# Altium schematic sheet Weather Station.SchDoc
size A4; DrawnBy: Rajesh Jasti; DocumentNumber: 1; Revision: ProtoType; SheetNumber: 1; SheetTotal: 1
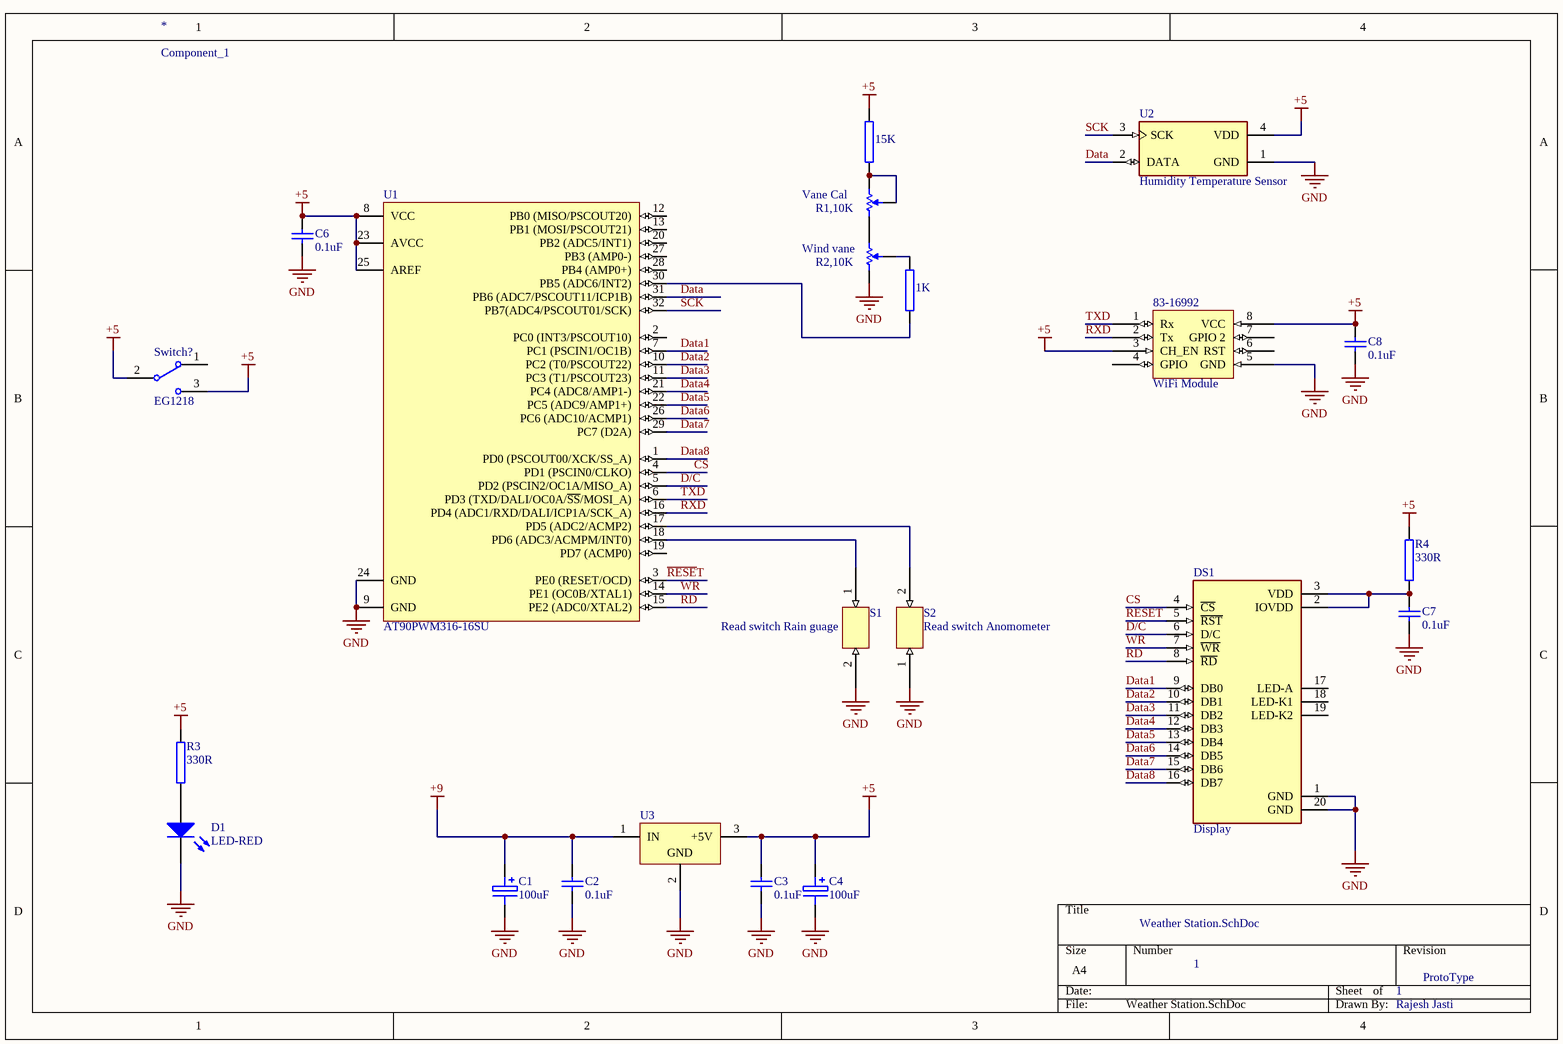
[diagram p0: Weather Station.SchDoc]

## Parts
1K  Resistor 1W  [AXIAL-0.7AUT]  (value not drawn)
15K  Resistor 1W  [AXIAL-0.7AUT]  (value not drawn)
83-16992  WiFi Module
*  Component_1
C1  100uF  [CAPP150-300_AUT]
C2  0.1uF  [RAD-0.1_AUT]
C3  0.1uF  [RAD-0.1_AUT]
C4  100uF  [CAPP150-300_AUT]
C6  0.1uF  [CAP_1206]
C7  0.1uF  [CAP_1206]
C8  0.1uF  [CAP_1206]
D1  LED-RED  [LED3MM_R_AUT]
DS1  Display  [MODULE_NHD-1.8-128160EF-CSXN#]
R1,10K  Vane Cal  [BOUR-TC33X-2_V]
R2,10K  Wind vane  [BOUR-TC33X-2_V]
R3  330R  [AXIAL-0.4AUT]
R4  330R  [AXIAL-0.4AUT]
S1  Read switch Rain guage
S2  Read switch Anomometer
Switch?  EG1218  [ESWI-EG1218_V]
U1  AT90PWM316-16SU  [SO32_M]
U2  Humidity Temperature Sensor  [XDCR_SHT11]
U3  (no value)  [TO-220H]

## Nets
+5: 15K.2 83-16992.3(CH_EN) 83-16992.8(VCC) C3.2 C4.1 C6.2 C8.2 R3.2 R4.2 Switch?.2(COM) Switch?.3 U1.8(VCC) U1.23(AVCC) U1.25(AREF) U2.4(VDD) U3.3(+5V)
+9: C1.1 C2.2 U3.1(IN)
GND: 83-16992.5(GND) C1.2 C2.1 C3.1 C4.2 C6.1 C7.1 C8.1 D1.K DS1.1(GND) DS1.20(GND) R2,10K.1 S1.2 S2.1 U1.9(GND) U1.24(GND) U2.1(GND) U3.2(GND)
CS: DS1.4(~{CS}) U1.4(PD1_(PSCIN0/CLKO))
D/C: DS1.6(D/C) U1.5(PD2_(PSCIN2/OC1A/MISO_A))
Data: U1.31(PB6_(ADC7/PSCOUT11/ICP1B)) U2.2(DATA)
Data1: DS1.9(DB0) U1.7(PC1_(PSCIN1/OC1B))
Data2: DS1.10(DB1) U1.10(PC2_(T0/PSCOUT22))
Data3: DS1.11(DB2) U1.11(PC3_(T1/PSCOUT23))
Data4: DS1.12(DB3) U1.21(PC4_(ADC8/AMP1-))
Data5: DS1.13(DB4) U1.22(PC5_(ADC9/AMP1+))
Data6: DS1.14(DB5) U1.26(PC6_(ADC10/ACMP1))
Data7: DS1.15(DB6) U1.29(PC7_(D2A))
Data8: DS1.16(DB7) U1.1(PD0_(PSCOUT00/XCK/SS_A))
~{R}D: DS1.8(~{RD}) U1.15(PE2_(ADC0/XTAL2))
~{RESE}T: DS1.5(~{RST}) U1.3(PE0_(RESET/OCD))
RXD: 83-16992.2(Tx) U1.16(PD4_(ADC1/RXD/DALI/ICP1A/SCK_A))
SCK: U1.32(PB7(ADC4/PSCOUT01/SCK)) U2.3(SCK)
TXD: 83-16992.1(Rx) U1.6(PD3_(TXD/DALI/OC0A/~{SS}/MOSI_A))
WR: DS1.7(~{WR}) U1.14(PE1_(OC0B/XTAL1))
Net1K_1: 1K.1 U1.30(PB5_(ADC6/INT2))
Net1K_2: 1K.2 R2,10K.2
Net15K_1: 15K.1 R1,10K.2 R1,10K.3
NetC7_2: C7.2 DS1.2(IOVDD) DS1.3(VDD) R4.1
NetD1_A: D1.A R3.1
NetR1,10K_1: R1,10K.1 R2,10K.3
NetS1_1: S1.1 U1.18(PD6_(ADC3/ACMPM/INT0))
NetS2_2: S2.2 U1.17(PD5_(ADC2/ACMP2))

Not connected (* = marked no-connect by the designer): 83-16992 4(GPIO) 6(RST) 7(GPIO_2); DS1 17(LED-A) 18(LED-K1) 19(LED-K2); Switch? 1; U1 2(PC0_(INT3/PSCOUT10)) 12(PB0_(MISO/PSCOUT20)) 13(PB1_(MOSI/PSCOUT21)) 19(PD7_(ACMP0)) 20(PB2_(ADC5/INT1)) 27(PB3_(AMP0-)) 28(PB4_(AMP0+))

## Notes on the sheet
- ProtoType

## Library data of the parts
1K 15K = Resistor 1W: Resistor, Through Hole, Pitch 700mil
83-16992 = Component_1: Supplier 1: Newark; Supplier Part Number 1: 68Y0156
C1 C4 = CAPP150-300: Polarized Aluminum Capacitor, Through Hole, Pitch 150mil, Body 300mil (Dia)
C2 C3 = CAPN RAD0.1: Non Polarized Capacitor, Multilayer Ceramic Dipped Radial, Pitch 100mil
C6-C8 = CAPN 1206: Non Polarized Capacitor, SMD, 1206
D1 = 3mm LED-RED: 3mm RED LED, Through Hole; Supplier 1: Farnell; Supplier Part Number 1: 1003207
DS1 = NHD-1.8-128160EF-CSXN#: Graphic LCD Display Module Transmissive Red, Green, Blue (RGB) TFT - Color Parallel, 8-Bit 1.8 (45.72mm) 128 x 160; MF: Newhaven Display; Package: None; Value: *; Purchase-URL: https://pricing.snapeda.com/search/part/NHD-1.8-128160EF-CSXN#/?ref=eda; Availability: Warning; MP: NHD-1.8-128160EF-CSXN#; Check_prices: https://www.snapeda.com/parts/NHD-1.8-128160EF-CSXN%23/Newhaven%20Display%20Intl/view-part/426299/?ref=eda; SnapEDA_Link: https://www.snapeda.com/parts/NHD-1.8-128160EF-CSXN%23/Newhaven%20Display%20Intl/view-part/426299/?ref=snap; Price: None
R1,10K R2,10K = CMP-009-00060-1: Trimming Potentiometer, 10000 Ohm, -40 to 100 degC, 3-Pin SMD, RoHS, Tape and Reel; Manufacturer: Bourns; Power: 100mW; Tolerance: 25%; Resistance: 10k; Package Description: 3-Pin Surface Mount Device, Body 3.8 x 3.6 mm; Case/Package: TC33X-2; Datasheet Version: Aug-16; Manufacturer URL: http://www.bourns.com/; Min Operating Temperature: -40°C; Datasheet URL: http://www.bourns.com/docs/Product-Datasheets/TC33.pdf; Package Reference: TC33X-2; Packaging: TapeandReel; Composition: Potentiometer; Package Quantity: 2500; Max Operating Temperature: 120°C; RoHS Compliant: True; Mounting Technology: SM
R3 R4 = Resistor 1/4W: Resistor, Through Hole, Pitch 400mil
S1 S2 = R: Supplier 1: Digi-Key; Supplier Part Number 1: 306-1148-1-ND
Switch? = CMP-011-00006-1: Slide Switch, SPDT, 500 V, -20 to 70 degC, 3-Pin THD, RoHS, Bulk; Manufacturer: E-Switch; Operating Force: 250gf; Contact Current Rating: 200mA; Current Rating: 2dA; Voltage Rating (DC): 30V; Packaging: Bulk; Max Operating Temperature: 70°C; Contact Material: Copper; Datasheet URL: https://www.e-switch.com/system/asset/product_line/data_sheet/119/EG.pdf; Case/Package: EG1218; Min Operating Temperature: -20°C; Pins: 3; Throw Configuration: SPDT; Package Description: 3-Pin Through Hole Device, Body 11.6 x 4 mm, Pitch 2.5 mm; Voltage Rating (AC): 30V; Package Reference: EG1218; Datasheet Version: Oct-15; Package Quantity: 1000; Mounting Technology: TH; RoHS Compliant: True; Manufacturer URL: http://www.e-switch.ch/en/; Contact Plating: Silver; Contact Finish: Silver
U1 = AT90PWM316-16SU: 8-bit AVR Microcontroller, 2.7-5.5V, 16KB Flash, 512 Bytes EEPROM, 1KB SRAM; Supplier 1: Mouser; Supplier Part Number 1: 556-AT90PWM316-16SU
U2 = SHT11: Humidity Temperature Sensor 0 ~ 100% RH Digital Â±3% RH 8s Surface Mount; MF: Sensirion; SnapEDA_Link: https://www.snapeda.com/parts/SHT11/Sensirion/view-part/4481868/?ref=snap; Package: SMD-10 Sensirion; MP: SHT11; Value: *; Availability: Unavailable; Price: None
U3 = L78S05CV: 5V, 2A, LDO, TO-220-3; Supplier 1: Farnell; Supplier Part Number 1: 9756086